# Altium schematic sheet ADC.SchDoc: Analog to Digital Converter (ADC)
size 254 x 127 mm; DrawnBy: Kace Chandler; DocumentNumber: 7; SheetNumber: 7; SheetTotal: 23
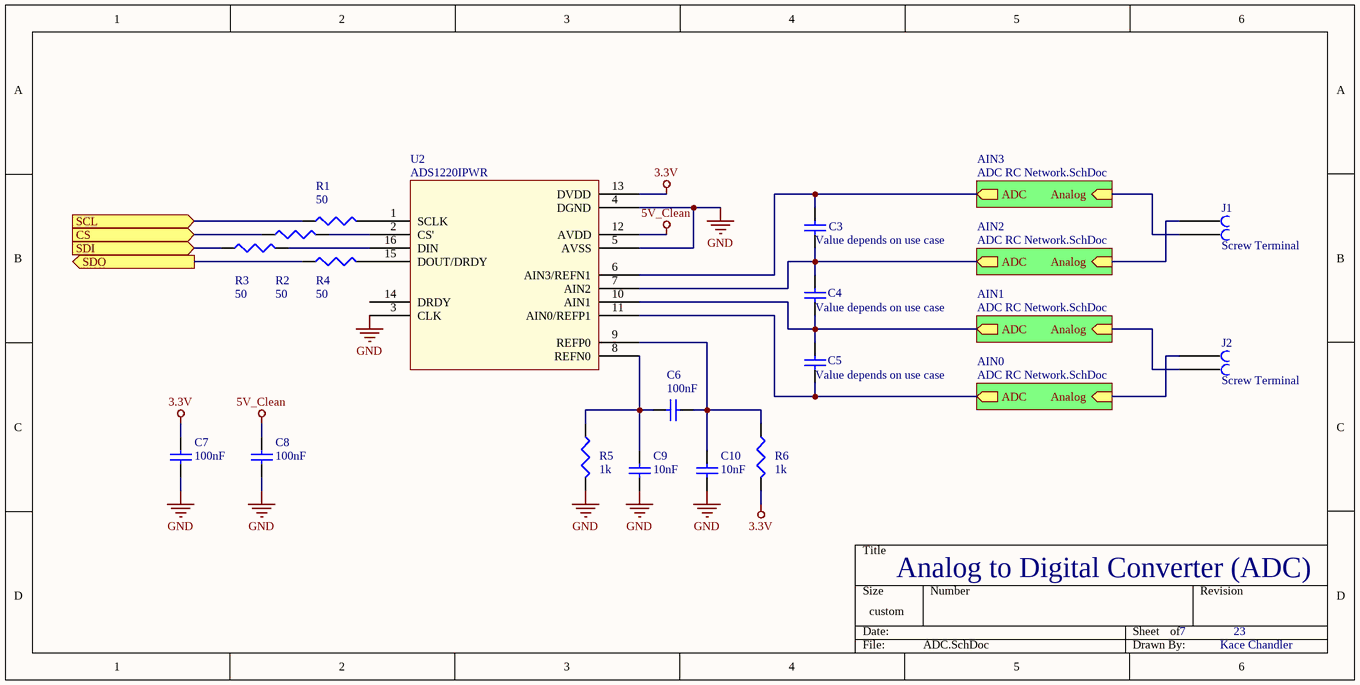
[diagram p0: ADC.SchDoc]

## Parts
C3  value Value depends on use case  [0603 to 0805 SMD]  (hidden comment: Cap)
C4  value Value depends on use case  [0603 to 0805 SMD]  (hidden comment: Cap)
C5  value Value depends on use case  [0603 to 0805 SMD]  (hidden comment: Cap)
C6  value 100nF  [0603 to 0805 SMD]  (hidden comment: Cap)
C7  value 100nF  [0603 Footprint]  (hidden comment: Cap)
C8  value 100nF  [0603 Footprint]  (hidden comment: Cap)
C9  value 10nF  [0603 to 0805 SMD]  (hidden comment: Cap)
C10  value 10nF  [0603 to 0805 SMD]  (hidden comment: Cap)
J1  Screw Terminal  [Screw Terminal]
J2  Screw Terminal  [Screw Terminal]
R1  value 50  (hidden comment: Res3)
R2  value 50  (hidden comment: Res3)
R3  value 50  (hidden comment: Res3)
R4  value 50  (hidden comment: Res3)
R5  value 1k  (hidden comment: Res3)
R6  value 1k  (hidden comment: Res3)
U2  MP: ADS1220IPWR  [SOP65P640X120-16N]  (hidden comment: Analog to Digital Converter)

## Sub-sheets
AIN0 = ADC RC Network.SchDoc: ADC (out), Analog (in)
AIN1 = ADC RC Network.SchDoc: ADC (out), Analog (in)
AIN2 = ADC RC Network.SchDoc: ADC (out), Analog (in)
AIN3 = ADC RC Network.SchDoc: ADC (out), Analog (in)

## Ports
CS (in), SCL (in), SDI (in), SDO (out)

## Nets
3.3V: C7.2 R6.2 U2.13(DVDD)
5V_Clean: C8.2 U2.12(AVDD)
GND: C7.1 C8.1 C9.1 C10.1 R5.2 U2.3(CLK) U2.4(DGND) U2.5(AVSS)
CS: R2.1 ; port CS
SCL: R1.1 ; port SCL
SDI: R3.1 ; port SDI
SDO: R4.1 ; port SDO
NetC3_1: C3.1 C4.1 U2.7(AIN2) ; sheet AIN2/ADC
NetC3_2: C3.2 U2.6(AIN3/REFN1) ; sheet AIN3/ADC
NetC4_2: C4.2 C5.2 U2.10(AIN1) ; sheet AIN1/ADC
NetC5_1: C5.1 U2.11(AIN0/REFP1) ; sheet AIN0/ADC
NetC6_1: C6.1 C9.2 R5.1 U2.8(REFN0)
NetC6_2: C6.2 C10.2 R6.1 U2.9(REFP0)
NetJ1_1: J1.1 ; sheet AIN2/Analog
NetJ1_2: J1.2 ; sheet AIN3/Analog
NetJ2_1: J2.1 ; sheet AIN0/Analog
NetJ2_2: J2.2 ; sheet AIN1/Analog
NetR1_2: R1.2 U2.1(SCLK)
NetR2_2: R2.2 U2.2(CS')
NetR3_2: R3.2 U2.16(DIN)
NetR4_2: R4.2 U2.15(DOUT/DRDY)

Not connected (* = marked no-connect by the designer): U2 14(DRDY)

## Library data of the parts
C3-C5 = Cap: Capacitor; Published: 8-Jun-2000; LatestRevisionDate: 17-Jul-2002; LatestRevisionNote: Re-released for DXP Platform.; PackageReference: RAD-0.3; Publisher: Altium Limited; PackageDescription: Radial Cap, Thru-Hole; 2 Leads; 0.3 in Pin Spacing
R1-R6 = Res3: Resistor; Published: 8-Jun-2000; LatestRevisionDate: 29-May-2009; LatestRevisionNote: IPC-7351 Footprint Added.; PackageReference: J1-0603; Publisher: Altium Limited; PackageDescription: Chip Resistor
U2 = Analog to Digital Converter: SOP65P640X120-16N; Supplier 1: Digi-Key; Supplier Part Number 1: 296-39851-1-ND
J1 J2 = Screw Terminal: Supplier 1: Digi-Key; Supplier Part Number 1: A112762-ND